# EAGLE schematic pcb (EAGLE 7.5.0)
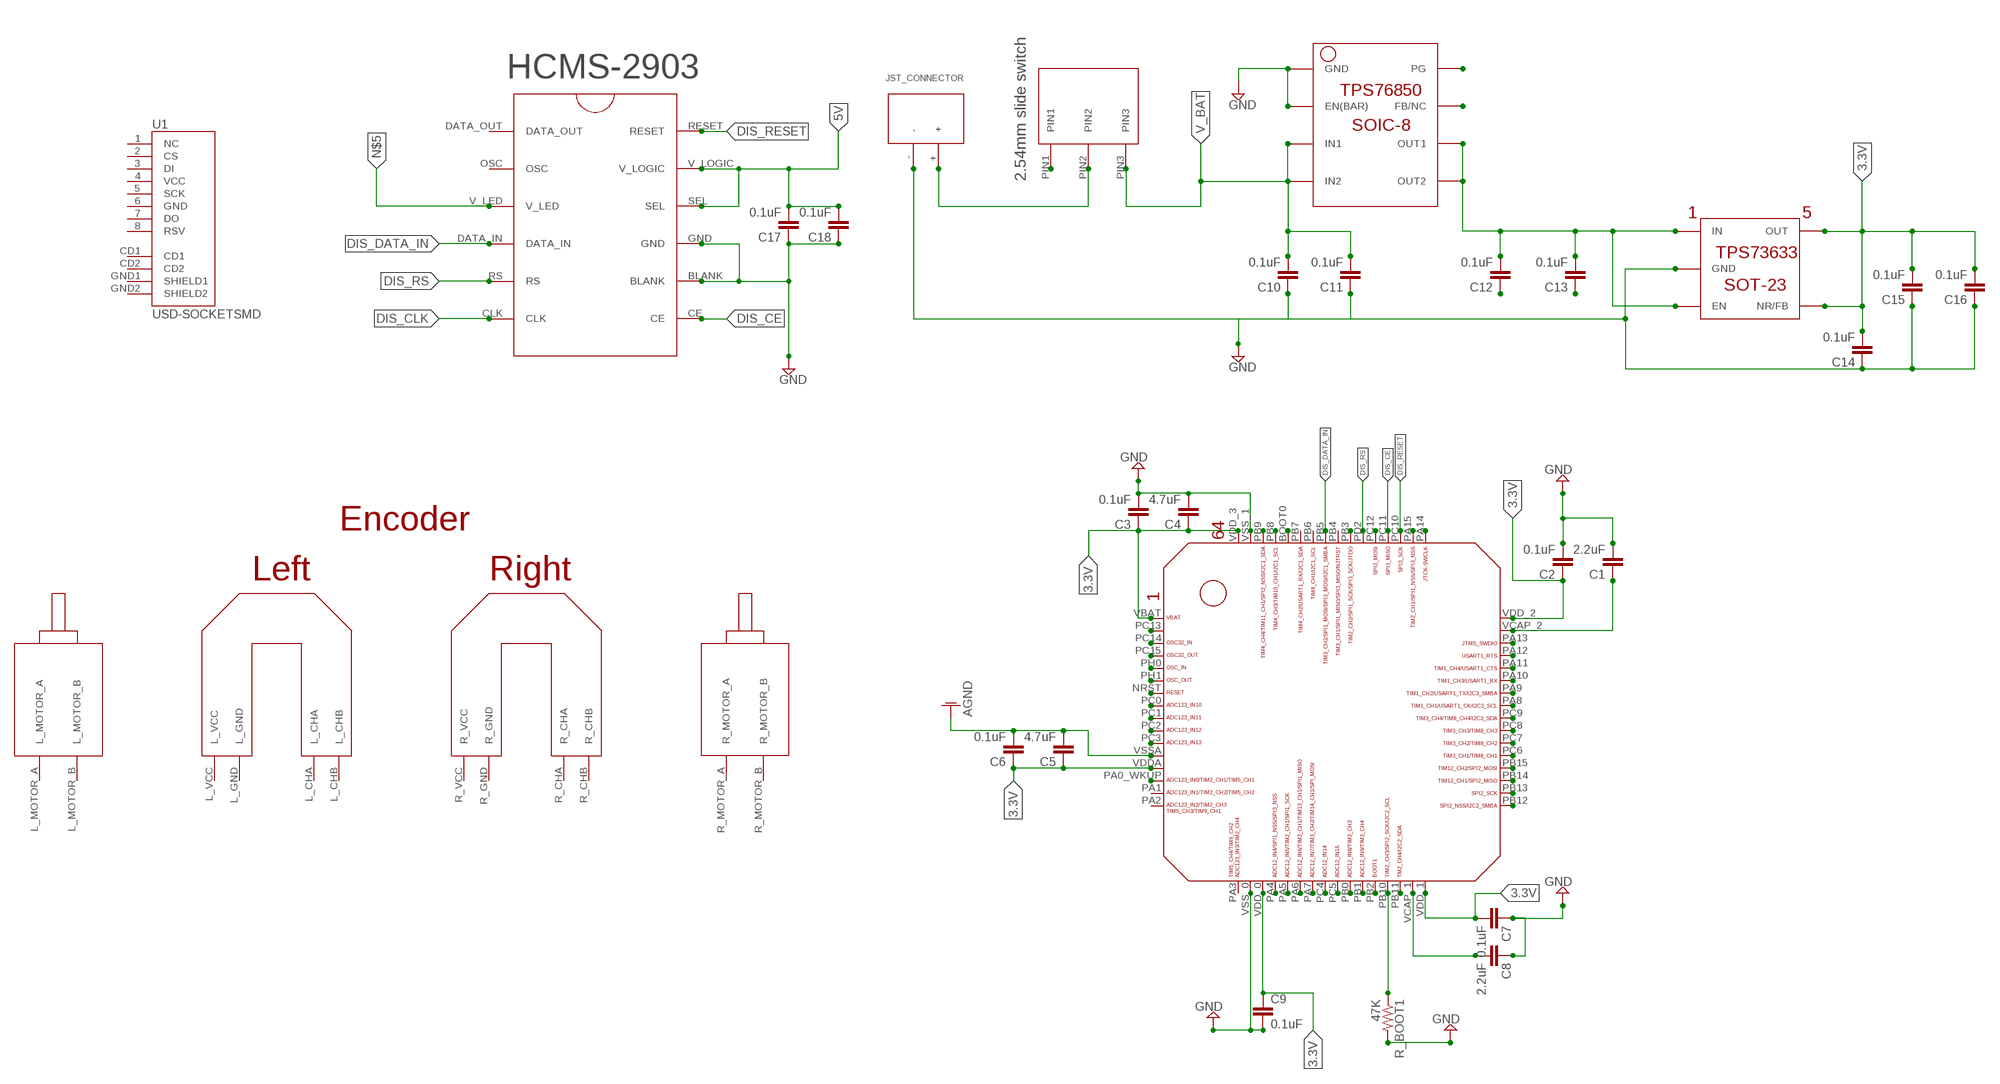
[diagram p0: schematic, sheet 1]

## Parts
C1  2.2uF  CAP0402-CAP  [0402-CAP]
C2  0.1uF  CAP0402-CAP  [0402-CAP]
C3  0.1uF  CAP0402-CAP  [0402-CAP]
C4  4.7uF  CAP0402-CAP  [0402-CAP]
C5  4.7uF  CAP0402-CAP  [0402-CAP]
C6  0.1uF  CAP0402-CAP  [0402-CAP]
C7  0.1uF  CAP0402-CAP  [0402-CAP]
C8  2.2uF  CAP0402-CAP  [0402-CAP]
C9  0.1uF  CAP0402-CAP  [0402-CAP]
C10  0.1uF  CAP0402-CAP  [0402-CAP]
C11  0.1uF  CAP0402-CAP  [0402-CAP]
C12  0.1uF  CAP0402-CAP  [0402-CAP]
C13  0.1uF  CAP0402-CAP  [0402-CAP]
C14  0.1uF  CAP0402-CAP  [0402-CAP]
C15  0.1uF  CAP0402-CAP  [0402-CAP]
C16  0.1uF  CAP0402-CAP  [0402-CAP]
C17  0.1uF  CAP0402-CAP  [0402-CAP]
C18  0.1uF  CAP0402-CAP  [0402-CAP]
R_BOOT1  47K  RESISTOR0603-RES  [0603-RES]
U1  USD-SOCKETSMD  [MICRO-SD-SOCKET-PP]
U$1  FUTURA_V1.0_MOTOR_MOUNT  [FUTURA_V1.0_MOTOT_MOUNT]
U$2  STM32F405/415_LQFP64  [STM32F405/415_LQFP64]
U$3  TPS76850(SOIC-8)  [TPS76850(SOIC-8)]
U$4  TPS73633(SOT-23)  [TPS73633(SOT-23)]
U$5  JST_CONNECTOR_FEMALE  [JST_CONNECTOR_FEMALE]
U$6  TS02_SWITCH  [TS02_SWITCH]
U$7  HCMS-2903  [HCMS-2903]

## Nets
3.3V: C2.1 C3.1 C4.1 C5.1 C6.1 C7.2 C9.1 C14.2 C15.2 C16.2 U$2.VBAT U$2.VDD_0 U$2.VDD_1 U$2.VDD_2 U$2.VDD_3 U$2.VDDA U$4.NR/FB U$4.OUT
5V: C17.2 C18.2 U$7.SEL U$7.V_LOGIC
AGND: C5.2 C6.2 U$2.VSSA
BOOT1: R_BOOT1.2 ; supply symbol labelled GND
DIS_CE: U$2.PC11 U$7.CE
DIS_CLK: U$7.CLK
DIS_DATA_IN: U$2.PB5 U$7.DATA_IN
DIS_RESET: U$2.PC10 U$7.RESET
DIS_RS: U$2.PD2 U$7.RS
GND: C1.2 C2.2 C3.2 C4.2 C7.1 C8.1 C9.2 C10.1 C11.1 C14.1 C15.1 C16.1 C17.1 C18.1 U$2.VSS_0 U$2.VSS_1 U$3.EN(BAR) U$3.GND U$4.GND U$5.- U$7.BLANK U$7.GND
N$1: U$5.+ U$6.PIN2
N$2: C1.1 U$2.VCAP_2
N$3: U$2.PB9
N$4: U$2.PB8
N$5: U$7.V_LED
N$6: U$6.PIN1
N$7: U$2.BOOT0
N$12: U$2.PB3
N$14: U$2.PC12
N$17: U$2.PA15
N$18: U$2.PA14
N$21: U$2.PA13
N$22: U$2.PA12
N$23: U$2.PA11
N$24: U$2.PA10
N$25: U$2.PA9
N$26: U$2.PA8
N$27: U$2.PC9
N$28: U$2.PC8
N$29: U$2.PC7
N$30: U$2.PC6
N$31: U$2.PB15
N$32: U$2.PB14
N$33: U$2.PB13
N$34: U$2.PB12
N$36: C8.2 U$2.VCAP_1
N$37: U$2.PB11
N$38: R_BOOT1.1 U$2.PB10
N$39: U$2.PB2
N$40: U$2.PB1
N$41: U$2.PB0
N$42: U$2.PC5
N$43: U$2.PC4
N$44: U$2.PA7
N$45: U$2.PA6
N$46: U$2.PA5
N$47: U$2.PA4
N$51: C12.1
N$53: U$2.PA0_WKUP(PA0_AKUP)
N$54: U$3.FB/NC
N$55: U$3.PG
N$56: U$2.PC3
N$57: U$2.PC2
N$58: U$2.PC1
N$59: U$2.PC0
N$60: U$2.NRST
N$61: U$2.PH1
N$62: U$2.PH0
N$63: U$2.PC15
N$64: U$2.PC14
N$65: U$2.PC13
N$68: C12.2 C13.2 U$3.OUT1 U$3.OUT2 U$4.EN U$4.IN
N$72: C13.1
V_BAT: C10.2 C11.2 U$3.IN1 U$3.IN2 U$6.PIN3
Unconnected: U1.1(NC) U1.2(CS) U1.3(DI) U1.4(VCC) U1.5(SCK) U1.6(GND) U1.7(DO) U1.8(RSV) U1.CD1 U1.CD2 U1.GND1(SHIELD1) U1.GND2(SHIELD2) U$1.L_CHA U$1.L_CHB U$1.L_GND U$1.L_MOTOR_A U$1.L_MOTOR_B U$1.L_VCC U$1.R_CHA U$1.R_CHB U$1.R_GND U$1.R_MOTOR_A U$1.R_MOTOR_B U$1.R_VCC U$2.PA1 U$2.PA2 U$2.PA3 U$2.PB4 U$2.PB6 U$2.PB7 U$7.DATA_OUT U$7.OSC

## Library data of the parts
C1-C18 = SparkFun:CAP: Capacitor Standard 0603 ceramic capacitor, and 0.1" leaded capacitor.
R_BOOT1 = SparkFun:RESISTOR: Resistor Basic schematic elements and footprints for 0603, 1206, and PTH resistors.
U1 = SparkFun:USD-SOCKET: microSD Socket Push-push type uSD socket. Schematic element and footprint production proven. Spark Fun Electronics SKU : PRT-00127. tDoc lines correctly indicate media card edge positions when inserting (unlocked, locked, depressed).
U$1 = Futura 1.0 motor mount template:FUTURA_V1.0_MOTOR_MOUNT
U$2 = STM32F10x F4xx:STM32F405/415_LQFP64
U$3 = TPS76850(SOIC-8):TPS76850(SOIC-8)
U$4 = TPS73633(SOT-23):TPS73633(SOT-23)
U$5 = JST_CONNECTOR_FEMALE. through hole:JST_CONNECTOR_FEMALE
U$6 = 2.54mm slide switch:TS02_SWITCH
U$7 = HCMS-2903:HCMS-2903